# Altium schematic sheet DCCDecoder.SchDoc
size A3
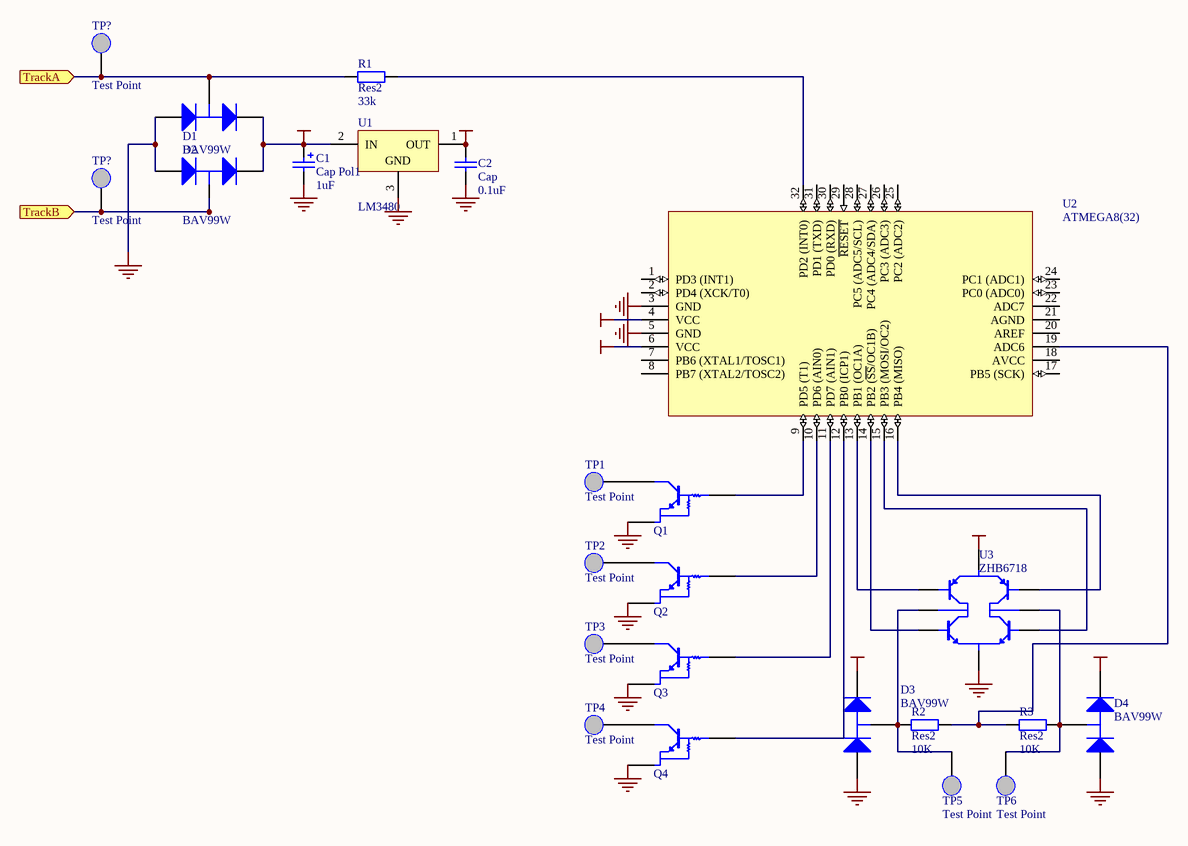
[diagram p0: DCCDecoder.SchDoc]

## Parts
(Parts that share a designator on the sheet are numbered #1, #2 ... from top to bottom, then left to right.)
C1  Cap Pol1  value 1uF  [CC3216-1206]
C2  Cap  value 0.1uF  [CC2012-0805]
D1  BAV99W  [SOT-323]
D2  BAV99W  [SOT-323]
D3  BAV99W  [SOT-323]
D4  BAV99W  [SOT-323]
Q1  UN2212  [SO-G3]  (value not drawn)
Q2  UN2212  [SO-G3]  (value not drawn)
Q3  UN2212  [SO-G3]  (value not drawn)
Q4  UN2212  [SO-G3]  (value not drawn)
R1  Res2  value 33k  [CC2012-0805]
R2  Res2  value 10K  [CC2012-0805]
R3  Res2  value 10K  [CC2012-0805]
TP1  Test Point  [TestPoint]
TP2  Test Point  [TestPoint]
TP3  Test Point  [TestPoint]
TP4  Test Point  [TestPoint]
TP5  Test Point  [TestPoint]
TP6  Test Point  [TestPoint]
TP?#1  Test Point  [TestPoint]
TP?#2  Test Point  [TestPoint]
U1  LM3480  [SO-G3]
U2  ATMEGA8(32)  [32M1-A]
U3  ZHB6718  [SOT223-8]

## Ports
TrackA (in), TrackB (in)

## Nets
GND: C1.2 C2.1 D1.1(A) D2.1(A) D3.1(A) D4.1(A) Q1.2(E) Q2.2(E) Q3.2(E) Q4.2(E) U1.3(GND) U2.3(GND) U2.5(GND) U3.2(e2,e3)
VCC: C2.2 U1.1(OUT) U2.4(VCC) U2.6(VCC)
Vdd: C1.1 D1.2(K) D2.2(K) D3.2(K) D4.2(K) U1.2(IN) U3.6(e1,e4)
TrackA: D1.3(C) R1.1 TP?#1.1 ; port TrackA
TrackB: D2.3(C) TP?#2.1 ; port TrackB
NetD3_3: D3.3(C) R2.1 TP5.1 U3.5(c1,c2)
NetD4_3: D4.3(C) R3.2 TP6.1 U3.7(c3,c4)
NetQ1_1: Q1.1(B) U2.9(PD5_(T1))
NetQ1_3: Q1.3(C) TP1.1
NetQ2_1: Q2.1(B) U2.10(PD6_(AIN0))
NetQ2_3: Q2.3(C) TP2.1
NetQ3_1: Q3.1(B) U2.11(PD7_(AIN1))
NetQ3_3: Q3.3(C) TP3.1
NetQ4_1: Q4.1(B) U2.12(PB0_(ICP1))
NetQ4_3: Q4.3(C) TP4.1
NetR1_2: R1.2 U2.32(PD2_(INT0))
NetR2_2: R2.2 R3.1 U2.19(ADC6)
NetU2_13: U2.13(PB1_(OC1A)) U3.4(b1)
NetU2_14: U2.14(PB2_(~{SS}/OC1B)) U3.3(b2)
NetU2_15: U2.15(PB3_(MOSI/OC2)) U3.1(b3)
NetU2_16: U2.16(PB4_(MISO)) U3.8(b4)

Not connected (* = marked no-connect by the designer): U2 1(PD3_(INT1)) 2(PD4_(XCK/T0)) 7(PB6_(XTAL1/TOSC1)) 8(PB7_(XTAL2/TOSC2)) 17(PB5_(SCK)) 18(AVCC) 20(AREF) 21(AGND) 22(ADC7) 23(PC0_(ADC0)) 24(PC1_(ADC1)) 25(PC2_(ADC2)) 26(PC3_(ADC3)) 27(PC4_(ADC4/SDA)) 28(PC5_(ADC5/SCL)) 29(~{RESET}) 30(PD0_(RXD)) 31(PD1_(TXD))

## Library data of the parts
C1 = Cap Pol1: Polarized Capacitor (Radial); Published: 8-Jun-2000; Revision: July-2002: Re-released for DXP Platform.; Publisher: Altium Limited
C2 = Cap: Capacitor; Published: 8-Jun-2000; Revision: July-2002: Re-released for DXP Platform.; Publisher: Altium Limited
D1-D4 = BAV99W: Silicon Switching Diode Array for High-Speed Switching; Package Information: Latest Revision: Sep-2001; Published: 21-Mar-2003; Datasheet: Latest Revision: Oct-1999; Package Reference: SOT-323; Publisher: Altium Limited
Q1-Q4 = UN2212: Bias Resistor Transistor
R1-R3 = Res2: Resistor; Published: 8-Jun-2000; Revision: July-2002: Re-released for DXP Platform.; Publisher: Altium Limited
TP1-TP6 TP?#1 TP?#2 = TestPoint
U1 = LM7805CT: Series 3-Terminal Positive Regulator; Package Information: Latest Revision: 1995; Note: Tab is connected to GND; Published: 15-Apr-2002; Datasheet: Latest Revision: May-1999; Package Reference: T03B; Publisher: Altium Limited
U2 = ATMEGA8(32): 8-Bit AVR Microcontroller; Package Information: Latest Revision: revB, Oct-2001; Code - JEDEC: MS-026-ABA; Published: 17-Sep-2003; Datasheet: Latest Revision: 1042G-AVR-09/02; Package Reference: 32A; Publisher: Altium Limited